# Altium schematic sheet SensorBoard.SchDoc
size A3
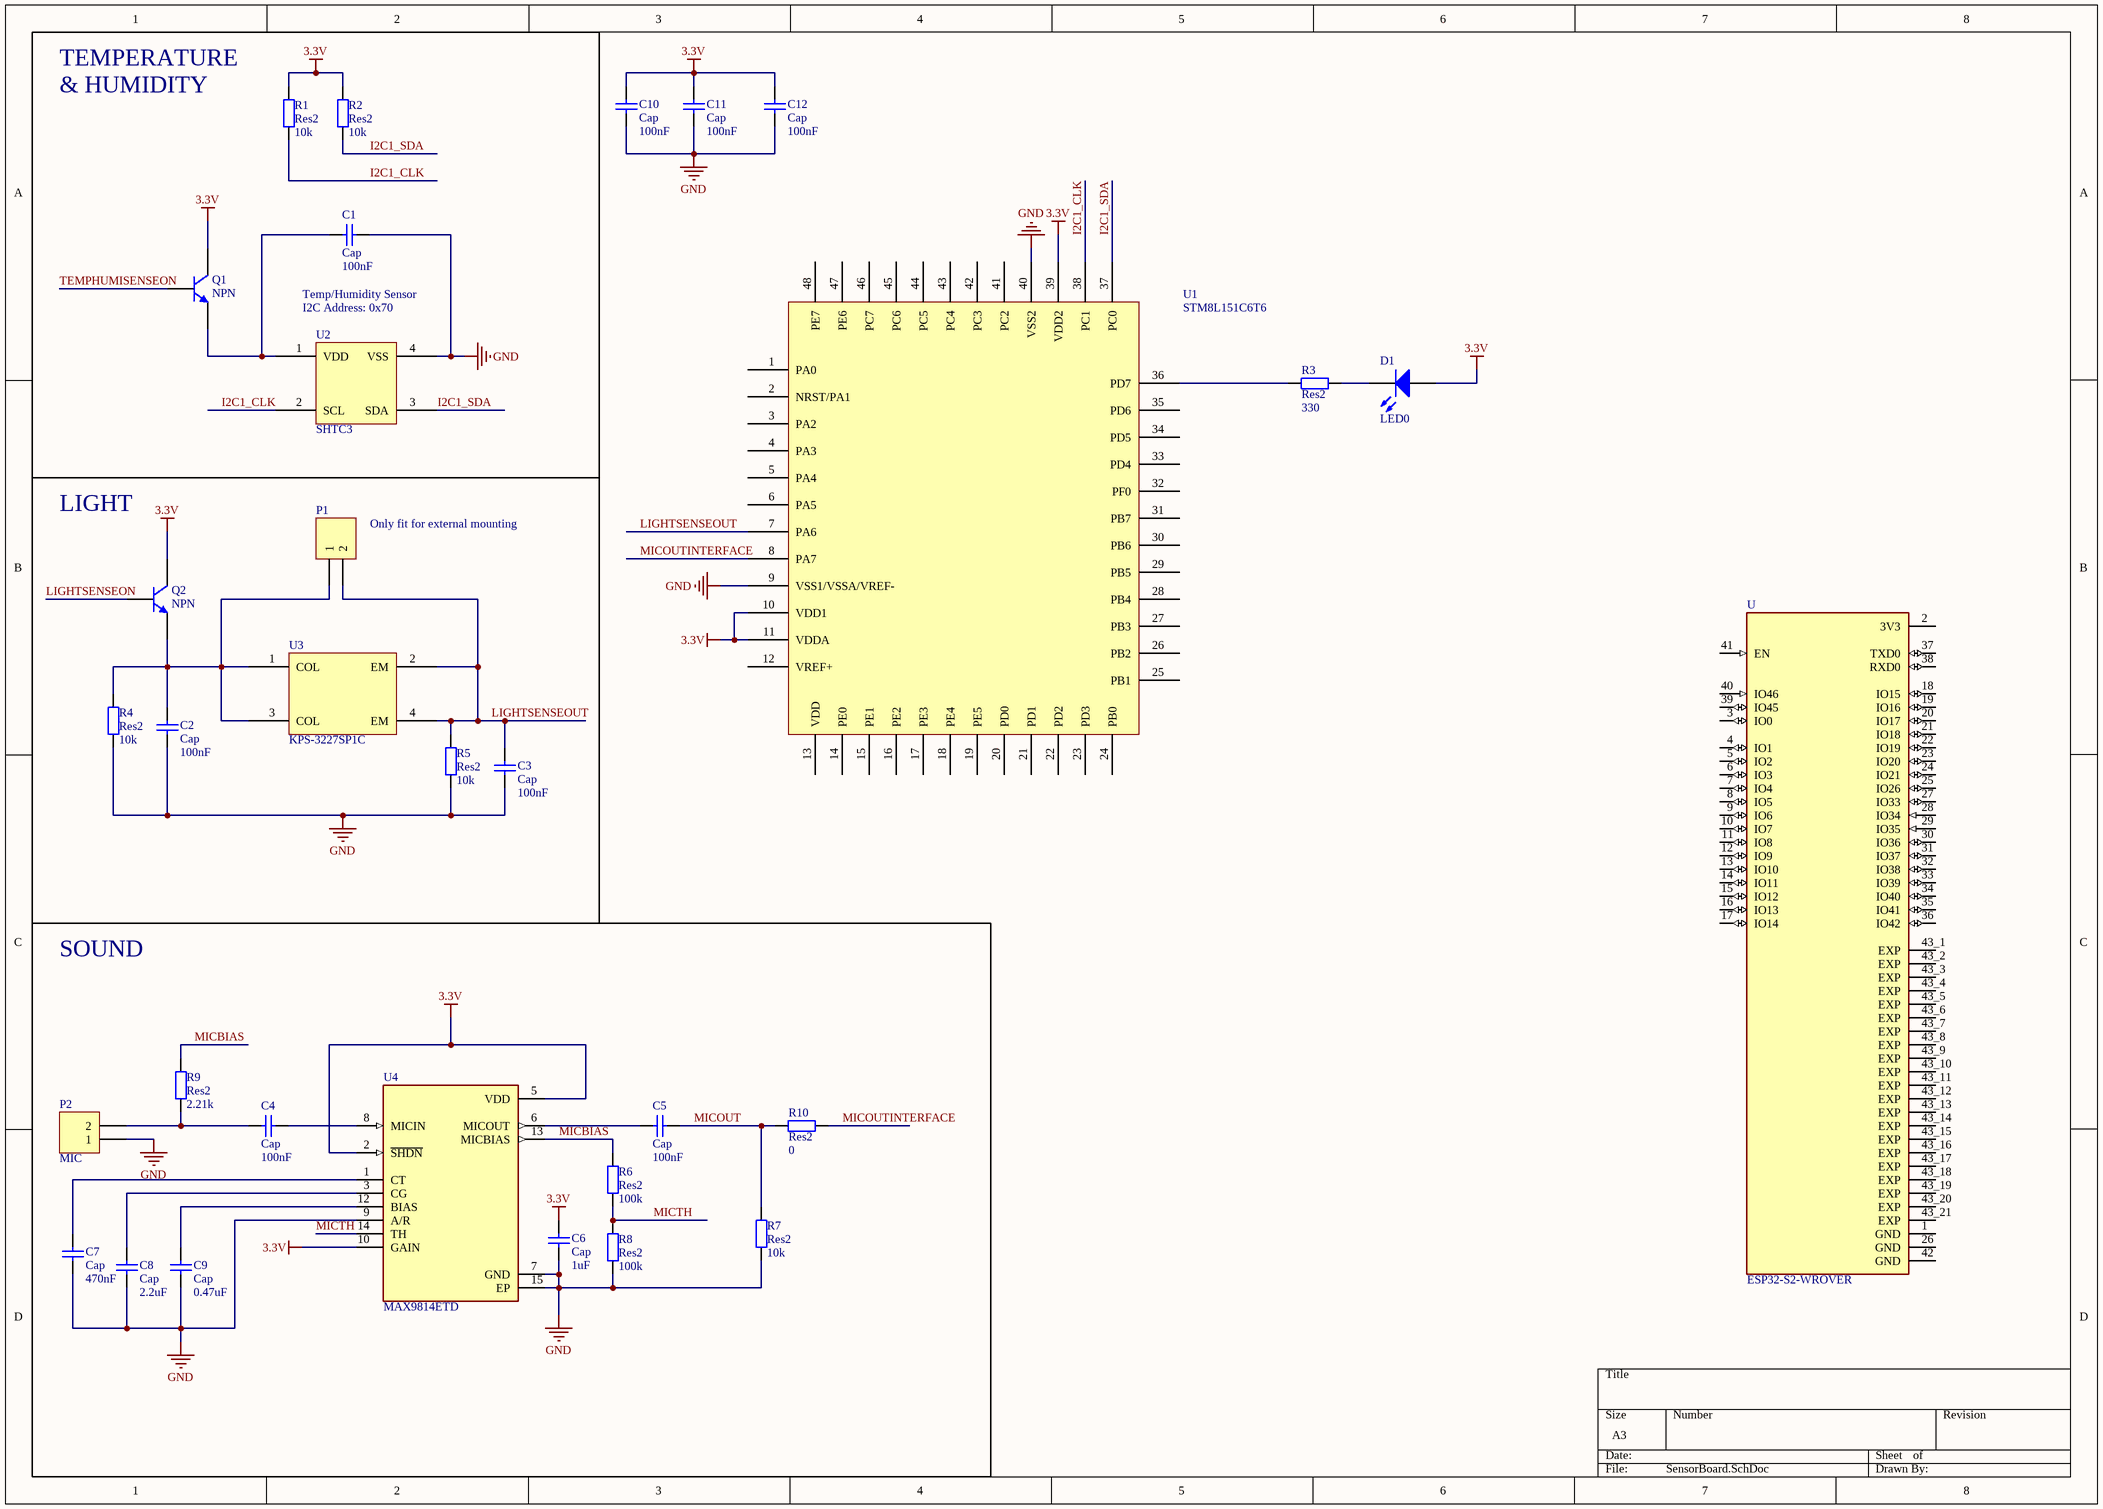
[diagram p0: SensorBoard.SchDoc]

## Parts
C1  Cap  value 100nF  [RAD-0.3]
C2  Cap  value 100nF  [RAD-0.3]
C3  Cap  value 100nF  [RAD-0.3]
C4  Cap  value 100nF  [RAD-0.3]
C5  Cap  value 100nF  [RAD-0.3]
C6  Cap  value 1uF  [RAD-0.3]
C7  Cap  value 470nF  [RAD-0.3]
C8  Cap  value 2.2uF  [RAD-0.3]
C9  Cap  value 0.47uF  [RAD-0.3]
C10  Cap  value 100nF  [RAD-0.3]
C11  Cap  value 100nF  [RAD-0.3]
C12  Cap  value 100nF  [RAD-0.3]
D1  LED0  [LED-0]
P1  Only fit for external mounting  [HDR1X2]
P2  MIC  [HDR1X2]
Q1  NPN  [TO-226-AA]
Q2  NPN  [TO-226-AA]
R1  Res2  value 10k  [AXIAL-0.4]
R2  Res2  value 10k  [AXIAL-0.4]
R3  Res2  value 330  [AXIAL-0.4]
R4  Res2  value 10k  [AXIAL-0.4]
R5  Res2  value 10k  [AXIAL-0.4]
R6  Res2  value 100k  [AXIAL-0.4]
R7  Res2  value 10k  [AXIAL-0.4]
R8  Res2  value 100k  [AXIAL-0.4]
R9  Res2  value 2.21k  [AXIAL-0.4]
R10  Res2  value 0  [AXIAL-0.4]
U  ESP32-S2-WROVER  [MODULE_ESP32-S2-WROVER]
U1  STM8L151C6T6
U2  SHTC3
U3  KPS-3227SP1C
U4  MAX9814ETD  [MAX9814ETD]

## Blocks framed on the sheet
LIGHT: C2 C3 P1 Q2 R4 R5 U3
SOUND: C4-C9 P2 R6-R10 U4

## Nets
3.3V: C6.1 C10.2 C11.2 C12.2 D1.1(A) Q1.1(C) Q2.1(C) R1.2 R2.2 U1.10(VDD1) U1.11(VDDA) U1.39(VDD2) U4.2(~{SHDN}) U4.5(VDD) U4.10(GAIN)
GND: C1.2 C2.1 C3.1 C6.2 C7.2 C8.2 C9.2 C10.1 C11.1 C12.1 P2.1 R4.1 R5.1 R7.1 R8.1 U1.9(VSS1/VSSA/VREF-) U1.40(VSS2) U2.4(VSS) U4.7(GND) U4.9(A/R) U4.15(EP)
I2C1_CLK: R1.1 U1.38(PC1) U2.2(SCL)
I2C1_SDA: R2.1 U1.37(PC0) U2.3(SDA)
LIGHTSENSEON: Q2.2(B)
LIGHTSENSEOUT: C3.2 P1.2 R5.2 U1.7(PA6) U3.2(EM) U3.4(EM)
MICBIAS: R6.2 R9.2 U4.13(MICBIAS)
MICOUT: C5.2 R7.2 R10.2
MICOUTINTERFACE: R10.1 U1.8(PA7)
MICTH: R6.1 R8.2 U4.14(TH)
TEMPHUMISENSEON: Q1.2(B)
NetC1_1: C1.1 Q1.3(E) U2.1(VDD)
NetC2_2: C2.2 P1.1 Q2.3(E) R4.2 U3.1(COL) U3.3(COL)
NetC4_1: C4.1 P2.2 R9.1
NetC4_2: C4.2 U4.8(MICIN)
NetC5_1: C5.1 U4.6(MICOUT)
NetC7_1: C7.1 U4.1(CT)
NetC8_1: C8.1 U4.3(CG)
NetC9_1: C9.1 U4.12(BIAS)
NetD1_2: D1.2(K) R3.2
NetR3_1: R3.1 U1.36(PD7)

Not connected (* = marked no-connect by the designer): U 1(GND) 2(3V3) 3(IO0) 4(IO1) 5(IO2) 6(IO3) 7(IO4) 8(IO5) 9(IO6) 10(IO7) 11(IO8) 12(IO9) 13(IO10) 14(IO11) 15(IO12) 16(IO13) 17(IO14) 18(IO15) 19(IO16) 20(IO17) 21(IO18) 22(IO19) 23(IO20) 24(IO21) 25(IO26) 26(GND) 27(IO33) 28(IO34) 29(IO35) 30(IO36) 31(IO37) 32(IO38) 33(IO39) 34(IO40) 35(IO41) 36(IO42) 37(TXD0) 38(RXD0) 39(IO45) 40(IO46) 41(EN) 42(GND) 43_1(EXP) 43_2(EXP) 43_3(EXP) 43_4(EXP) 43_5(EXP) 43_6(EXP) 43_7(EXP) 43_8(EXP) 43_9(EXP) 43_10(EXP) 43_11(EXP) 43_12(EXP) 43_13(EXP) 43_14(EXP) 43_15(EXP) 43_16(EXP) 43_17(EXP) 43_18(EXP) 43_19(EXP) 43_20(EXP) 43_21(EXP); U1 1(PA0) 2(NRST/PA1) 3(PA2) 4(PA3) 5(PA4) 6(PA5) 12(VREF+) 13(VDD) 14(PE0) 15(PE1) 16(PE2) 17(PE3) 18(PE4) 19(PE5) 20(PD0) 21(PD1) 22(PD2) 23(PD3) 24(PB0) 25(PB1) 26(PB2) 27(PB3) 28(PB4) 29(PB5) 30(PB6) 31(PB7) 32(PF0) 33(PD4) 34(PD5) 35(PD6) 41(PC2) 42(PC3) 43(PC4) 44(PC5) 45(PC6) 46(PC7) 47(PE6) 48(PE7)

## Notes on the sheet
- TEMPERATURE
- & HUMIDITY
- Temp/Humidity Sensor
- (near U2) I2C Address: 0x70

## Library data of the parts
C1-C12 = Cap: Capacitor; Published: 8-Jun-2000; LatestRevisionDate: 17-Jul-2002; LatestRevisionNote: Re-released for DXP Platform.; PackageReference: RAD-0.3; Publisher: Altium Limited; PackageDescription: Radial Cap, Thru-Hole; 2 Leads; 0.3 in Pin Spacing
D1 = LED0: Typical INFRARED GaAs LED; Published: 8-Jun-2000; LatestRevisionDate: 08-Jul-2005; LatestRevisionNote: Mech Layer 1 removed.; PackageReference: LED-0; Publisher: Altium Limited; PackageDescription: LED; 2 Leads
P1 P2 = Header 2: Header, 2-Pin; LatestRevisionDate: 17-Jul-2002; LatestRevisionNote: Re-released for DXP Platform.; Publisher: Altium Limited
Q1 Q2 = NPN: NPN Bipolar Transistor; Published: 8-Jun-2000; LatestRevisionDate: 17-Jul-2002; LatestRevisionNote: Re-released for DXP Platform.; PackageReference: TO-226-AA; Publisher: Altium Limited; PackageDescription: TO, Flat Index; 3 In-Line, Axial Leads; Body Dia. 4.8mm; Leads 0.55 x 0.51 mm (max); Code_JEDEC: TO-226-AA
R1-R10 = Res2: Resistor; Published: 8-Jun-2000; LatestRevisionDate: 17-Jul-2002; LatestRevisionNote: Re-released for DXP Platform.; PackageReference: AXIAL-0.4; Publisher: Altium Limited; PackageDescription: Axial Device, Thru-Hole; 2 Leads; 0.4 in Pin Spacing
U = ESP32-S2-WROVER: WiFi 802.11b/g/n Transceiver Module 2.4GHz Antenna Not Included Surface Mount; MF: Espressif Systems; SnapEDA_Link: https://www.snapeda.com/parts/ESP32-S2-WROVER/Espressif%20Systems/view-part/4614060/?ref=snap; Package: VFQFN-56 Espressif Systems; MP: ESP32-S2-WROVER; Value: *; Availability: Unavailable; Price: None
U2 = SHTC3: Manufacturer: Sensirion; Manufacturer Number: SHTC3